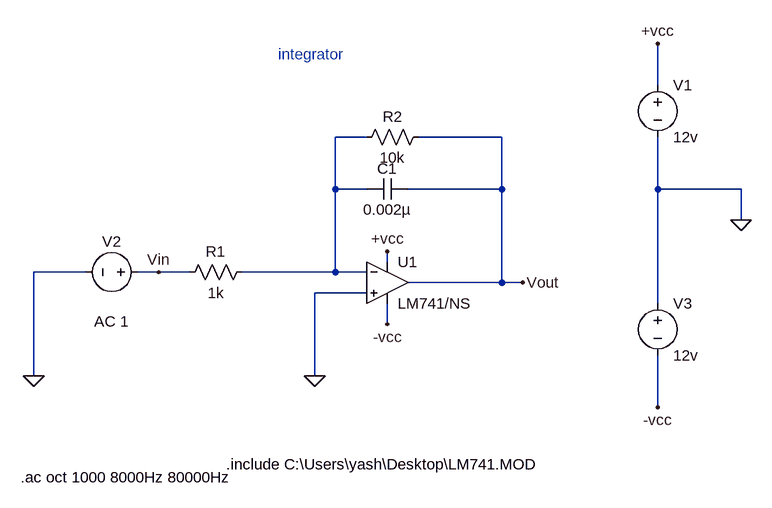
[diagram p0: schematic integrator circuit.asc]
integrator circuit.asc, the LTspice schematic file:
Version 4
SHEET 1 880 680
WIRE 672 -256 672 -320
WIRE 224 -176 176 -176
WIRE 432 -176 304 -176
WIRE 176 -96 176 -176
WIRE 224 -96 176 -96
WIRE 432 -96 432 -176
WIRE 432 -96 288 -96
WIRE 672 -96 672 -176
WIRE 800 -96 672 -96
WIRE 800 -48 800 -96
WIRE 256 16 256 0
WIRE -208 32 -288 32
WIRE -96 32 -128 32
WIRE -48 32 -96 32
WIRE 176 32 176 -96
WIRE 176 32 32 32
WIRE 224 32 176 32
WIRE 432 48 432 -96
WIRE 432 48 288 48
WIRE 464 48 432 48
WIRE 224 64 144 64
WIRE 672 80 672 -96
WIRE 256 112 256 80
WIRE -288 192 -288 32
WIRE 144 192 144 64
WIRE 672 240 672 160
FLAG 144 192 0
FLAG -288 192 0
FLAG 464 48 Vout
FLAG -96 32 Vin
FLAG 800 -48 0
FLAG 256 0 +vcc
FLAG 672 -320 +vcc
FLAG 256 112 -vcc
FLAG 672 240 -vcc
SYMBOL OpAmps\\opamp2 256 -16 R0
SYMATTR InstName U1
SYMATTR Value LM741/NS
SYMBOL res 48 16 R90
WINDOW 0 0 56 VBottom 2
WINDOW 3 32 56 VTop 2
SYMATTR InstName R1
SYMATTR Value 1k
SYMBOL res 320 -192 R90
WINDOW 0 0 56 VBottom 2
WINDOW 3 32 56 VTop 2
SYMATTR InstName R2
SYMATTR Value 10k
SYMBOL cap 288 -112 R90
WINDOW 0 0 32 VBottom 2
WINDOW 3 32 32 VTop 2
SYMATTR InstName C1
SYMATTR Value 0.002µ
SYMBOL voltage -112 32 R90
WINDOW 0 -32 56 VBottom 2
WINDOW 3 32 56 VTop 2
WINDOW 123 60 56 VTop 2
WINDOW 39 0 0 Left 0
SYMATTR InstName V2
SYMATTR Value ""
SYMATTR Value2 AC 1
SYMBOL voltage 672 -272 R0
WINDOW 123 0 0 Left 0
WINDOW 39 0 0 Left 0
SYMATTR InstName V1
SYMATTR Value 12v
SYMBOL voltage 672 64 R0
WINDOW 123 0 0 Left 0
WINDOW 39 0 0 Left 0
SYMATTR InstName V3
SYMATTR Value 12v
TEXT 8 328 Left 2 !.include C:\\Users\\yash\\Desktop\\LM741.MOD
TEXT -308 348 Left 2 !.ac oct 1000 8000Hz 80000Hz
TEXT 88 -304 Left 2 ;integrator

The netlist it stands for:
* integrator circuit.asc
XU1 0 N001 +vcc -vcc Vout LM741/NS  ; pins In+ In- V+ V- OUT
R1 N001 Vin 1k
R2 Vout N001 10k
C1 Vout N001 0.002µ
V2 Vin 0 AC 1
V1 +vcc 0 12v
V3 0 -vcc 12v
.include C:\Users\yash\Desktop\LM741.MOD
.ac oct 1000 8000Hz 80000Hz
* integrator
.backanno
.end